# EAGLE design Papa_Soundie (EAGLE 8.7.0)

## Sheet 1 of 2
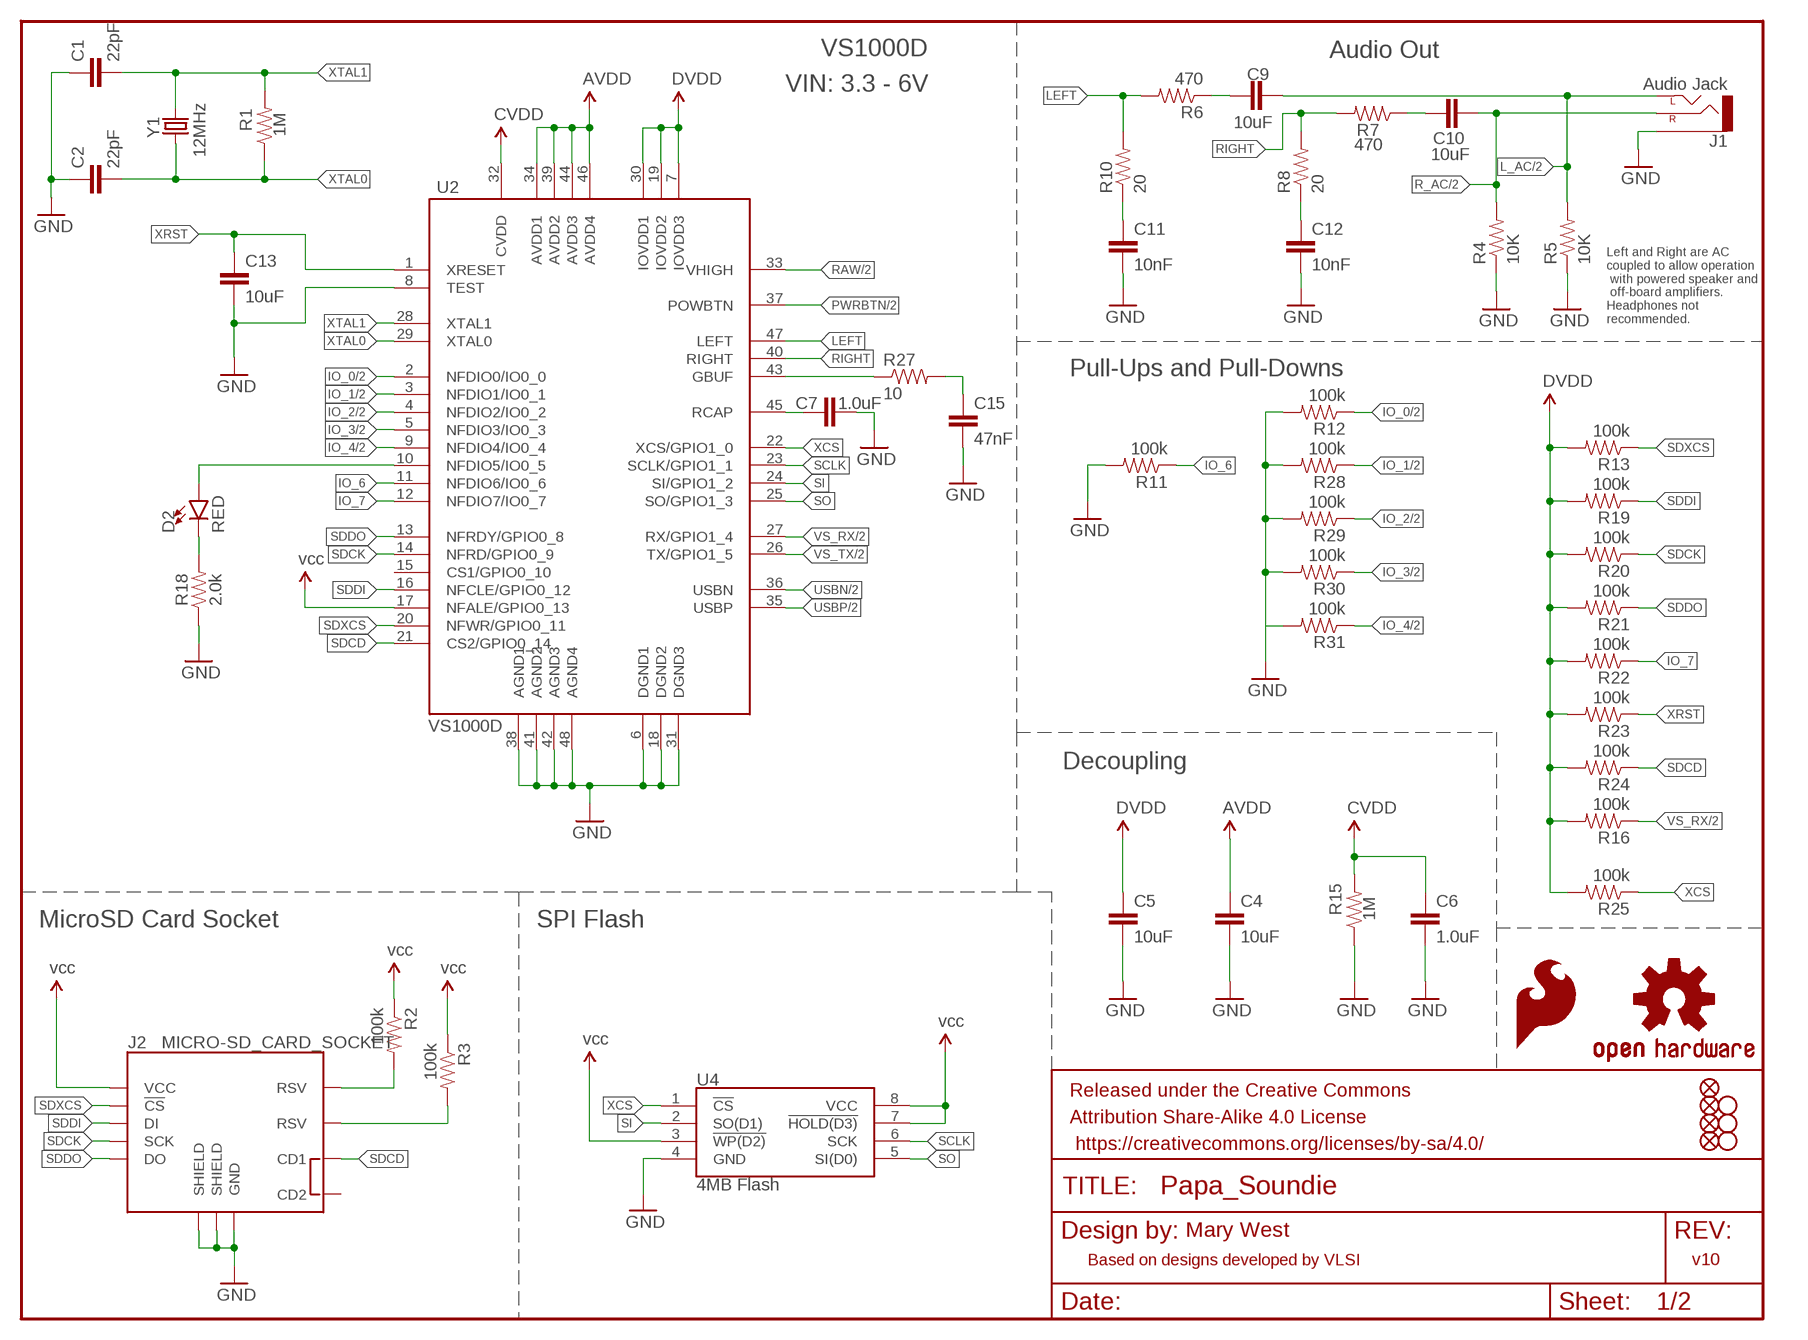
[diagram p0: schematic, sheet 1]

### Parts
C1  22pF  22PF-50V-5%(0603)  [0603-CAP]
C2  22pF  22PF-50V-5%(0603)  [0603-CAP]
C4  10uF  10UF-0603-6.3V-20%  [0603]
C5  10uF  10UF-0603-6.3V-20%  [0603]
C6  1.0uF  1.0UF-16V-10%(0603)  [0603-CAP]
C7  1.0uF  1.0UF-16V-10%(0603)  [0603-CAP]
C9  10uF  10UF-6.3V-20%(0603)  [0603-CAP]
C10  10uF  10UF-6.3V-20%(0603)  [0603-CAP]
C11  10nF  10NF/10000PF-50V-10%(0603)  [0603-CAP]
C12  10nF  10NF/10000PF-50V-10%(0603)  [0603-CAP]
C13  10uF  10UF-6.3V-20%(0603)  [0603-CAP]
C15  47nF  47NF(0.047UF/47000PF)-25V-5%(0603)SMD  [0603-CAP]
D2  RED  LED-RED0603  [LED-0603]
FD1  FIDUCIALUFIDUCIAL  [FIDUCIAL-MICRO]
FD2  FIDUCIALUFIDUCIAL  [FIDUCIAL-MICRO]
FD3  FIDUCIALUFIDUCIAL  [FIDUCIAL-MICRO]
FD4  FIDUCIALUFIDUCIAL  [FIDUCIAL-MICRO]
FRAME1  FRAME-LETTER  [CREATIVE_COMMONS]
H1  STAND-OFFTIGHT  [STAND-OFF-TIGHT]
H2  STAND-OFFTIGHT  [STAND-OFF-TIGHT]
H3  STAND-OFFTIGHT  [STAND-OFF-TIGHT]
J1  Audio Jack  AUDIO-JACKSMD2  [AUDIO-JACK-3.5MM-SMD]
J2  MICRO-SD_CARD_SOCKET  [MICRO-SD-SOCKET]
LOGO1  OSHW-LOGOL  [OSHW-LOGO-L]
LOGO2  SFE_LOGO_FLAME.2_INCH  [SFE_LOGO_FLAME_.2]
R1  1M  1MOHM-1/10W-1%(0603)  [0603-RES]
R2  100k  100KOHM-1/10W-1%(0603)  [0603-RES]
R3  100k  100KOHM-1/10W-1%(0603)  [0603-RES]
R4  10K  10KOHM-1/10W-1%(0603)0603  [0603-RES]
R5  10K  10KOHM-1/10W-1%(0603)0603  [0603-RES]
R6  470  470OHM1/10W1%(0603)  [0603-RES]
R7  470  470OHM1/10W1%(0603)  [0603-RES]
R8  20  20OHM1/10W1%(0603)SMD  [0603-RES]
R10  20  20OHM1/10W1%(0603)SMD  [0603-RES]
R11  100k  100KOHM-1/10W-1%(0603)  [0603-RES]
R12  100k  100KOHM-1/10W-1%(0603)  [0603-RES]
R13  100k  100KOHM-1/10W-1%(0603)  [0603-RES]
R15  1M  1MOHM-1/10W-1%(0603)  [0603-RES]
R16  100k  100KOHM-1/10W-1%(0603)  [0603-RES]
R18  2.0k  2.0KOHM-0603-1/10W-5%  [0603]
R19  100k  100KOHM-1/10W-1%(0603)  [0603-RES]
R20  100k  100KOHM-1/10W-1%(0603)  [0603-RES]
R21  100k  100KOHM-1/10W-1%(0603)  [0603-RES]
R22  100k  100KOHM-1/10W-1%(0603)  [0603-RES]
R23  100k  100KOHM-1/10W-1%(0603)  [0603-RES]
R24  100k  100KOHM-1/10W-1%(0603)  [0603-RES]
R25  100k  100KOHM-1/10W-1%(0603)  [0603-RES]
R27  10  10OHM-1/10W-5%0603SMD  [0603-RES]
R28  100k  100KOHM-1/10W-1%(0603)  [0603-RES]
R29  100k  100KOHM-1/10W-1%(0603)  [0603-RES]
R30  100k  100KOHM-1/10W-1%(0603)  [0603-RES]
R31  100k  100KOHM-1/10W-1%(0603)  [0603-RES]
U2  VS1000D  VS1000  [LQFP-48]
U4  4MB Flash  AT25SF041  [SO08]
Y1  12MHz  CRYSTALCRYSTAL-SMD-5X3-12MHZ  [CRYSTAL-SMD-5X3]

### Nets
AVDD: C4.1 U2.34(AVDD1) U2.39(AVDD2) U2.44(AVDD3) U2.46(AVDD4)
CVDD: C6.1 R15.2 U2.32(CVDD)
DVDD: C5.1 R13.2 R16.2 R19.2 R20.2 R21.2 R22.2 R23.2 R24.2 R25.2 U2.7(IOVDD3) U2.19(IOVDD2) U2.30(IOVDD1)
GBUF: R27.1 U2.43(GBUF)
GND: C1.1 C2.1 C4.2 C5.2 C6.2 C7.2 C11.2 C12.2 C13.2 C15.2 J1.SLEEVE J2.GND J2.GND1(SHIELD) J2.GND3(SHIELD) R4.1 R5.1 R11.2 R12.2 R15.1 R18.1 R28.2 R29.2 R30.2 R31.2 U2.6(DGND1) U2.8(TEST) U2.18(DGND2) U2.31(DGND3) U2.38(AGND1) U2.41(AGND2) U2.42(AGND3) U2.48(AGND4) U4.4(GND) ; also sheet 2
IO_0: R12.1 U2.2(NFDIO0/IO0_0) ; also sheet 2
IO_1: R28.1 U2.3(NFDIO1/IO0_1) ; also sheet 2
IO_2: R29.1 U2.4(NFDIO2/IO0_2) ; also sheet 2
IO_3: R30.1 U2.5(NFDIO3/IO0_3) ; also sheet 2
IO_4: R31.1 U2.9(NFDIO4/IO0_4) ; also sheet 2
IO_6: R11.1 U2.11(NFDIO6/IO0_6)
IO_7: R22.1 U2.12(NFDIO7/IO0_7)
L_AC: C9.2 J1.TIP(LEFT) R5.2 ; also sheet 2
LEFT: R6.2 R10.2 U2.47(LEFT)
N$2: C15.1 R27.2
N$3: C9.1 R6.1
N$6: C11.1 R10.1
N$7: C7.1 U2.45(RCAP)
N$15: J2.RSV1(RSV) R2.2
N$17: C10.1 R7.1
N$19: J2.RSV2(RSV) R3.2
N$20: C12.1 R8.1
N$34: D2.C R18.2
N$35: D2.A U2.10(NFDIO5/IO0_5)
PWRBTN: U2.37(POWBTN) ; also sheet 2
R_AC: C10.2 J1.RING(RIGHT) R4.2 ; also sheet 2
RAW: U2.33(VHIGH) ; also sheet 2
RIGHT: R7.2 R8.2 U2.40(RIGHT)
SCLK: U2.23(SCLK/GPIO1_1) U4.6(SCK)
SDCD: J2.CD1 R24.1 U2.21(CS2/GPIO0_14)
SDCK: J2.SCLK(SCK) R20.1 U2.14(NFRD/GPIO0_9)
SDDI: J2.DI R19.1 U2.16(NFCLE/GPIO0_12)
SDDO: J2.DO R21.1 U2.13(NFRDY/GPIO0_8)
SDXCS: J2.CS(!CS) R13.1 U2.20(NFWR/GPIO0_11)
SI: U2.24(SI/GPIO1_2) U4.2(SO(D1))
SO: U2.25(SO/GPIO1_3) U4.5(SI(D0))
USBN: U2.36(USBN) ; also sheet 2
USBP: U2.35(USBP) ; also sheet 2
VCC: J2.VCC R2.1 R3.1 U2.17(NFALE/GPIO0_13) U4.3(!WP(D2)) U4.7(!HOLD(D3)) U4.8(VCC) ; supply symbol labelled vcc ; also sheet 2
VS_RX: R16.1 U2.27(RX/GPIO1_4) ; also sheet 2
VS_TX: U2.26(TX/GPIO1_5) ; also sheet 2
XCS: R25.1 U2.22(XCS/GPIO1_0) U4.1(!CS)
XRST: C13.1 R23.1 U2.1(XRESET)
XTAL0: C2.2 R1.1 U2.29(XTAL0) Y1.1
XTAL1: C1.2 R1.2 U2.28(XTAL1) Y1.3
Unconnected: J2.CD2 U2.15(CS1/GPIO0_10)

### Notes on the sheet
- VS1000D | Audio Out
- VIN: 3.3 - 6V
- Left and Right are AC
  coupled to allow operation
   with powered speaker and
   off-board amplifiers.
  Headphones not 
  recommended.
- Pull-Ups and Pull-Downs
- Decoupling
- MicroSD Card Socket | SPI Flash
- Mary West
- Based on designs developed by VLSI | v10

## Sheet 2 of 2
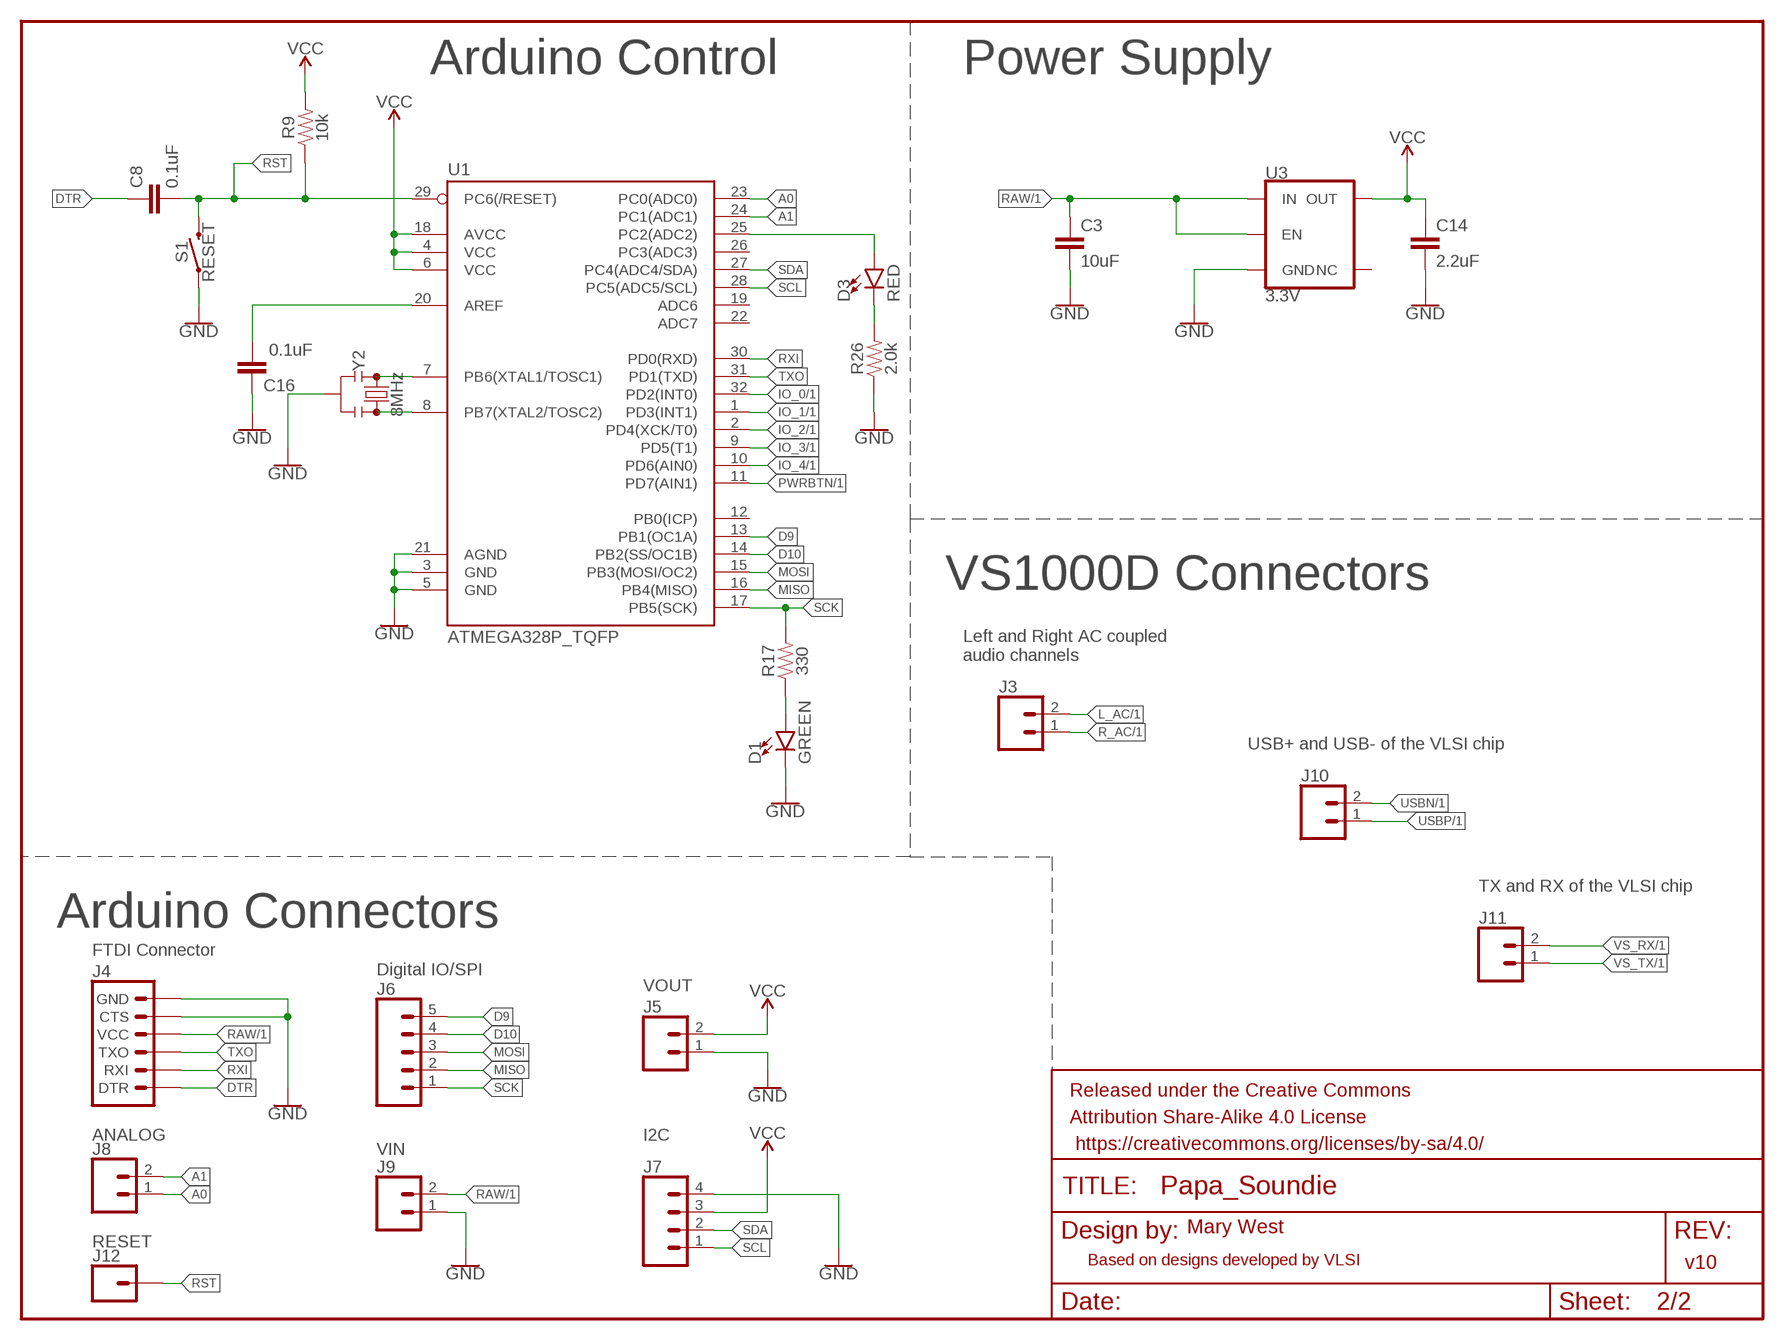
[diagram p1: schematic, sheet 2]

### Parts
C3  10uF  10UF-0603-6.3V-20%  [0603]
C8  0.1uF  0.1UF-0603-25V-(+80/-20%)  [0603]
C14  2.2uF  2.2UF-0603-10V-20%  [0603]
C16  0.1uF  0.1UF-0603-25V-(+80/-20%)  [0603]
D1  GREEN  LED-GREEN0603  [LED-0603]
D3  RED  LED-RED0603  [LED-0603]
FRAME2  FRAME-LETTER  [CREATIVE_COMMONS]
J3  CONN_02  [1X02]
J4  6_PIN_SERIAL_TARGETSILK  [6_PIN_SERIAL_TARGET_SIDE_W_SILK]
J5  CONN_02  [1X02]
J6  CONN_05  [1X05]
J7  CONN_04  [1X04]
J8  CONN_02  [1X02]
J9  CONN_02  [1X02]
J10  CONN_02  [1X02]
J11  CONN_02  [1X02]
J12  CONN_01  [1X01]
R9  10k  10KOHM-0603-1/10W-1%  [0603]
R17  330  330OHM-0603-1/10W-1%  [0603]
R26  2.0k  2.0KOHM-0603-1/10W-5%  [0603]
S1  RESET  MOMENTARY-SWITCH-SPST-SMD-5.2MM  [TACTILE_SWITCH_SMD_5.2MM]
U1  ATMEGA328P_TQFP  [TQFP32-08]
U3  3.3V  V_REG_AP2112K-3.3V  [SOT23-5]
Y2  8MHz  RESONATOR-8MHZSMD_3.2X1.3  [RESONATOR-SMD-3.2X1.3]

### Nets
A0: J8.1 U1.23(PC0(ADC0))
A1: J8.2 U1.24(PC1(ADC1))
D9: J6.5 U1.13(PB1(OC1A))
D10: J6.4 U1.14(PB2(SS/OC1B))
DTR: C8.1 J4.P$1(DTR)
GND: C3.2 C14.2 C16.1 D1.C J4.P$5(CTS) J4.P$6(GND) J5.1 J7.4 J9.1 R26.1 S1.1 U1.3(GND) U1.5(GND) U1.21(AGND) U3.2(GND) Y2.2 ; also sheet 1
IO_0: U1.32(PD2(INT0)) ; also sheet 1
IO_1: U1.1(PD3(INT1)) ; also sheet 1
IO_2: U1.2(PD4(XCK/T0)) ; also sheet 1
IO_3: U1.9(PD5(T1)) ; also sheet 1
IO_4: U1.10(PD6(AIN0)) ; also sheet 1
L_AC: J3.2 ; also sheet 1
MISO: J6.2 U1.16(PB4(MISO))
MOSI: J6.3 U1.15(PB3(MOSI/OC2))
N$8: U1.7(PB6(XTAL1/TOSC1)) Y2.1
N$16: U1.8(PB7(XTAL2/TOSC2)) Y2.3
N$31: D3.A U1.25(PC2(ADC2))
N$36: D3.C R26.2
N$39: C16.2 U1.20(AREF)
N$42: D1.A R17.1
PWRBTN: U1.11(PD7(AIN1)) ; also sheet 1
R_AC: J3.1 ; also sheet 1
RAW: C3.1 J4.P$4(VCC) J9.2 U3.1(IN) U3.3(EN) ; also sheet 1
RST: C8.2 J12.1 R9.1 S1.3 U1.29(PC6(/RESET))
RXI: J4.P$3(RXI) U1.30(PD0(RXD))
SCK: J6.1 R17.2 U1.17(PB5(SCK))
SCL: J7.1 U1.28(PC5(ADC5/SCL))
SDA: J7.2 U1.27(PC4(ADC4/SDA))
TXO: J4.P$2(TXO) U1.31(PD1(TXD))
USBN: J10.2 ; also sheet 1
USBP: J10.1 ; also sheet 1
VCC: C14.1 J5.2 J7.3 R9.2 U1.4(VCC) U1.6(VCC) U1.18(AVCC) U3.5(OUT) ; also sheet 1
VS_RX: J11.2 ; also sheet 1
VS_TX: J11.1 ; also sheet 1
Unconnected: U1.12(PB0(ICP)) U1.19(ADC6) U1.22(ADC7) U1.26(PC3(ADC3)) U3.4(NC)

### Notes on the sheet
- Arduino Control | Power Supply
- VS1000D Connectors
- Left and Right AC coupled 
  audio channels
- USB+ and USB- of the VLSI chip
- TX and RX of the VLSI chip
- Arduino Connectors
- FTDI Connector
- Digital IO/SPI
- VOUT
- ANALOG | I2C
- VIN
- Mary West
- RESET
- Based on designs developed by VLSI | v10

## Library data of the parts
C1 C2 = SparkFun-Capacitors:22PF-50V-5%(0603): CAP-07876; PROD_ID: CAP-07876
C3-C5 = SparkFun-Capacitors:10UF: 10.0µF ceramic capacitors A capacitor is a passive two-terminal electrical component used to store electrical energy temporarily in an electric field.; PROD_ID: CAP-11015
C6 C7 = SparkFun-Capacitors:1.0UF-16V-10%(0603): CAP-00868; PROD_ID: CAP-00868
C8 C16 = SparkFun-Capacitors:0.1UF: 0.1µF ceramic capacitors A capacitor is a passive two-terminal electrical component used to store electrical energy temporarily in an electric field.; PROD_ID: CAP-00810
C9 C10 C13 = SparkFun-Capacitors:10UF-6.3V-20%(0603): CAP-11015; PROD_ID: CAP-11015
C11 C12 = SparkFun-Capacitors:10NF/10000PF-50V-10%(0603): CAP-00867; PROD_ID: CAP-00867
C14 = SparkFun-Capacitors:2.2UF: 2.2µF ceramic capacitors A capacitor is a passive two-terminal electrical component used to store electrical energy temporarily in an electric field.; PROD_ID: CAP-07888
C15 = SparkFun-Capacitors:47NF(0.047UF/47000PF)-25V-5%(0603): CAP-08605; PROD_ID: CAP-08605
D1 = SparkFun-LED:LED-GREEN: Green SMD LED Used in manufacturing of various products at SparkFun Packages: 0603 - SMD 0603 package [Product Link] <http://www.futureelectronics.com/en/technologies/semiconductors/optoelectronics/leds/Pages/9894312-LTST-C190GKT.aspx?CrossPart=HSMG-C190&IM=0> LilyPad 1206 - SMD1206 LilyPad package [Product Link] <http://www.futureelectronics.com/en/Technologies/Product.aspx?ProductID=IN150NGHARVATEKCORPORATION2049943&IM=0> 1206 - SMD1206 package [Product Link] <http://www.futureelectronics.com/en/technologies/semiconductors/optoelectronics/leds/Pages/8315665-LTST-C150KGKT.aspx?IM=0> 1206 Bottom Mount -SMD 1206 Bottom Mount [Product Link] <http://www.digikey.com/product-detail/en/lite-on-inc/LTST-C230KGKT/160-1456-1-ND/386854> SparkFun Products: Pro Mini 328 -5V <https://www.sparkfun.com/products/821> RedBoard <https://www.sparkfun.com/products/12757> MP3 Trigger <https://www.sparkfun.com/products/13720> Makey Makey <https://www.sparkfun.com/products/11076>; PROD_ID: DIO-00821
D2 D3 = SparkFun-LED:LED-RED: Red SMD LED Used in manufacturing of most products at SparkFun Packages: 0603 - SMD 0603 package [Product Link] <http://docs.avagotech.com/docs/AV02-0551EN> 0603 SMART - SMD 0603 SMART package ( more efficient and expensive)[Product Link] <http://www.osram-os.com/Graphics/XPic2/00077099_0.pdf> 1206 - SMD1206 package [Product Link] <https://www.sparkfun.com/datasheets/DevTools/LilyPad/Q150OVS4.pdff> SparkFun Products: Pro Mini 328 -5V <https://www.sparkfun.com/products/821> RedBoard <https://www.sparkfun.com/products/12757> IOIO-OTG <https://www.sparkfun.com/products/13613>; PROD_ID: DIO-00819
FD1-FD4 = SparkFun-Aesthetics:FIDUCIAL: Fiducial Alignment Points Point-of-reference for pick-and-place machines and other optical instruments.
FRAME1 FRAME2 = SparkFun-Aesthetics:FRAME-LETTER: Schematic Frame - Letter Standard 8.5x11 US Letter frame
H1-H3 = SparkFun-Electromechanical:STAND-OFF: #4 Stand Off This is the mechanical footprint for a #4 phillips button head screw. Use the keepout ring to avoid running the screw head into surrounding components. SKU : PRT-00447
J1 = SparkFun-Connectors:AUDIO-JACK: 3.5mm Audio Jack Simple 3.5mm common PCB mount audio jack. Variant PTH is our storefront SKU PRT-08032; PROD_ID: CONN-10353
J2 = SparkFun-Connectors:MICRO-SD_CARD_SOCKET: microSD Socket for Transflash Push-push type µSD socket. tDoc lines correctly indicate media card edge positions when inserting (unlocked, locked, depressed). NOTE: CD1 and CD2 are connected internally, and the default detect state of the socket is detect pin to ground. SparkFun Products: WAV Trigger <https://www.sparkfun.com/products/13660> CAN-Bus Shield <https://www.sparkfun.com/products/13262> SparkFun Level Shifing microSD Breakout <https://www.sparkfun.com/products/13743>; PROD_ID: CONN-07820; SF_ID: PRT-00127
J3 J5 J8-J11 = SparkFun-Connectors:CONN_02: Multi connection point. Often used as Generic Header-pin footprint for 0.1 inch spaced/style header connections On any of the 0.1 inch spaced packages, you can populate with these: Break Away Headers - Straight <https://www.sparkfun.com/products/116> (PRT-00116) Break Away Male Headers - Right Angle <https://www.sparkfun.com/products/553> (PRT-00553) Female Headers <https://www.sparkfun.com/products/115> (PRT-00115) Break Away Headers - Machine Pin <https://www.sparkfun.com/products/117> (PRT-00117) Break Away Female Headers - Swiss Machine Pin <https://www.sparkfun.com/products/743> (PRT-00743) For SCREWTERMINALS and SPRING TERMINALS visit here: Screw Terimnals on SparkFun.com <https://www.sparkfun.com/search/results?term=Screw+Terminals> (5mm/3.5mm/2.54mm spacing) This device is also useful as a general connection point to wire up your design to another part of your project. Our various solder wires solder well into these plated through hole pads. Hook-Up Wire - Assortment (Stranded, 22 AWG) <https://www.sparkfun.com/products/11375> (PRT-11375) Hook-Up Wire - Assortment (Solid Core, 22 AWG) <https://www.sparkfun.com/products/11367> (PRT-11367) View the entire wire category on our website here <https://www.sparkfun.com/categories/141> Special notes: Molex polarized connector foot print use with: PRT-08233 with associated crimp pins and housings. 2.54_SCREWTERM for use with PRT-10571. 3.5mm Screw Terminal footprints for PRT-08084 5mm Screw Terminal footprints for use with PRT-08432
J4 = SparkFun-Connectors:6_PIN_SERIAL_TARGET: 6-pin header connection for use with the "FTDI BASIC" pinout - TARGET SIDE. Also known as "Arduino Serial Program Header". It is used to mate with our FTDI Basic serial programmers using the Arduino IDE. Note, this device has "TARGET" in the name. It is intended to be used on a design that contains a target micro-controller that you wish to program. The "sister" device, named "CABLE" is inteneded to be used on a design that usually lives on the end of your USB cable and prvides the converter chip (FTDI232 or FTDI231x) to commnicate serial RX/TX. You can populate with some of these: Break Away Headers - Straight <https://www.sparkfun.com/products/116> (PRT-00116) For reference (or to suit your programming needs) check out these designs: SparkFun FTDI Basic Breakout - 5V <https://www.sparkfun.com/products/9716> (DEV-09716) SparkFun FTDI Basic Breakout - 3.3V <https://www.sparkfun.com/products/9873> (DEV-09873) SparkFun FTDI SmartBasic <https://www.sparkfun.com/products/12935> (DEV-12935) SparkFun Beefy 3 - FTDI Basic Breakout <https://www.sparkfun.com/products/13746> (DEV-13746)
J6 = SparkFun-Connectors:CONN_05: Multi connection point. Often used as Generic Header-pin footprint for 0.1 inch spaced/style header connections On any of the 0.1 inch spaced packages, you can populate with these: Break Away Headers - Straight <https://www.sparkfun.com/products/116> (PRT-00116) Break Away Male Headers - Right Angle <https://www.sparkfun.com/products/553> (PRT-00553) Female Headers <https://www.sparkfun.com/products/115> (PRT-00115) Break Away Headers - Machine Pin <https://www.sparkfun.com/products/117> (PRT-00117) Break Away Female Headers - Swiss Machine Pin <https://www.sparkfun.com/products/743> (PRT-00743) For SCREWTERMINALS and SPRING TERMINALS visit here: Screw Terimnals on SparkFun.com <https://www.sparkfun.com/search/results?term=Screw+Terminals> (5mm/3.5mm/2.54mm spacing) This device is also useful as a general connection point to wire up your design to another part of your project. Our various solder wires solder well into these plated through hole pads. Hook-Up Wire - Assortment (Stranded, 22 AWG) <https://www.sparkfun.com/products/11375> (PRT-11375) Hook-Up Wire - Assortment (Solid Core, 22 AWG) <https://www.sparkfun.com/products/11367> (PRT-11367) View the entire wire category on our website here <https://www.sparkfun.com/categories/141> Special notes: Molex polarized connector foot print use with SKU : PRT-08231 with associated crimp pins and housings. 1MM SMD Version SKU: PRT-10208
J7 = SparkFun-Connectors:CONN_04: Multi connection point. Often used as Generic Header-pin footprint for 0.1 inch spaced/style header connections On any of the 0.1 inch spaced packages, you can populate with these: Break Away Headers - Straight <https://www.sparkfun.com/products/116> (PRT-00116) Break Away Male Headers - Right Angle <https://www.sparkfun.com/products/553> (PRT-00553) Female Headers <https://www.sparkfun.com/products/115> (PRT-00115) Break Away Headers - Machine Pin <https://www.sparkfun.com/products/117> (PRT-00117) Break Away Female Headers - Swiss Machine Pin <https://www.sparkfun.com/products/743> (PRT-00743) For SCREWTERMINALS and SPRING TERMINALS visit here: Screw Terimnals on SparkFun.com <https://www.sparkfun.com/search/results?term=Screw+Terminals> (5mm/3.5mm/2.54mm spacing) This device is also useful as a general connection point to wire up your design to another part of your project. Our various solder wires solder well into these plated through hole pads. Hook-Up Wire - Assortment (Stranded, 22 AWG) <https://www.sparkfun.com/products/11375> (PRT-11375) Hook-Up Wire - Assortment (Solid Core, 22 AWG) <https://www.sparkfun.com/products/11367> (PRT-11367) View the entire wire category on our website here <https://www.sparkfun.com/categories/141> Special notes: Molex polarized connector foot print use with SKU : PRT-08231 with associated crimp pins and housings. 1MM SMD Version SKU: PRT-10208; PROD_ID: CONN-09696
J12 = SparkFun-Connectors:CONN_01: Single connection point. Often used as Generic Header-pin footprint for 0.1 inch spaced/style header connections On any of the 0.1 inch spaced packages, you can populate with these: Break Away Headers - Straight <https://www.sparkfun.com/products/116> (PRT-00116) Break Away Male Headers - Right Angle <https://www.sparkfun.com/products/553> (PRT-00553) Female Headers <https://www.sparkfun.com/products/115> (PRT-00115) Break Away Headers - Machine Pin <https://www.sparkfun.com/products/117> (PRT-00117) Break Away Female Headers - Swiss Machine Pin <https://www.sparkfun.com/products/743> (PRT-00743) This device is also useful as a general connection point to wire up your design to another part of your project. Our various solder wires solder well into these plated through hole pads. Hook-Up Wire - Assortment (Stranded, 22 AWG) <https://www.sparkfun.com/products/11375> (PRT-11375) Hook-Up Wire - Assortment (Solid Core, 22 AWG) <https://www.sparkfun.com/products/11367> (PRT-11367) View the entire wire category on our website here <https://www.sparkfun.com/categories/141> Special notes: SMTSO-256-ET is a "flush mount" nut for a 4-40 screw. We mostly use this on specialty testbeds; it is a nice way to connect hardware to your PCB at an adjustable hieght. Also note, the SNAP packages are for using a snappable style connector. We sell a baggie of snaps and they are also used on two LilyPad designs: Snap Assortment - 30 pack (male and female) <https://www.sparkfun.com/products/11347> (DEV-11347) LilyPad Arduino SimpleSnap <https://www.sparkfun.com/products/10941> (DEV-10941) LilyPad SimpleSnap Protoboard <https://www.sparkfun.com/products/10940> (DEV-10940)
LOGO1 = SparkFun-Aesthetics:OSHW-LOGO: Open-Source Hardware (OSHW) Logo This logo indicates the piece of hardware it is found on incorporates a OSHW license and/or adheres to the definition of open source hardware found here: http://freedomdefined.org/OSHW
LOGO2 = SparkFun-Aesthetics:SFE_LOGO_FLAME: SparkFun Flame Logo This is the SparkFun flame logo. The logo on the schematic will always be the same size; the package variant is the height of the flame. Default layer for the logo on the board is tSilk.
R1 R15 = SparkFun-Resistors:1MOHM-1/10W-1%(0603): RES-07868; PROD_ID: RES-07868
R2 R3 R11-R13 R16 R19-R25 R28-R31 = SparkFun-Resistors:100KOHM-1/10W-1%(0603): RES-07828; PROD_ID: RES-07828
R4 R5 = SparkFun-Resistors:10KOHM-1/10W-1%(0603): RES-00824; PROD_ID: RES-00824
R6 R7 = SparkFun-Resistors:470OHM1/10W1%(0603): RES-07869; PROD_ID: RES-07869
R8 R10 = SparkFun-Resistors:20OHM1/10W1%(0603): RES-07862; PROD_ID: RES-07862
R9 = SparkFun-Resistors:10KOHM: 10kΩ resistor A resistor is a passive two-terminal electrical component that implements electrical resistance as a circuit element. Resistors act to reduce current flow, and, at the same time, act to lower voltage levels within circuits. - Wikipedia; PROD_ID: RES-00824
R17 = SparkFun-Resistors:330OHM: 330Ω resistor A resistor is a passive two-terminal electrical component that implements electrical resistance as a circuit element. Resistors act to reduce current flow, and, at the same time, act to lower voltage levels within circuits. - Wikipedia; PROD_ID: RES-00818
R18 R26 = SparkFun-Resistors:2.0KOHM: 2kΩ resistor A resistor is a passive two-terminal electrical component that implements electrical resistance as a circuit element. Resistors act to reduce current flow, and, at the same time, act to lower voltage levels within circuits. - Wikipedia; PROD_ID: RES-08296
R27 = SparkFun-Resistors:10OHM-1/10W-5%0603: RES-09834; PROD_ID: RES-09834
S1 = SparkFun-Switches:MOMENTARY-SWITCH-SPST: Momentary Switch (Pushbutton) - SPST Normally-open (NO) SPST momentary switches (buttons, pushbuttons). Variants PTH-12MM - 12mm square, through-hole Momentary Pushbutton Switch - 12mm Square <https://www.sparkfun.com/products/9190> (COM-09190) PTH-6.0MM, PTH-6.0MM-KIT - 6.0mm square, through-hole Mini Pushbutton Switch <https://www.sparkfun.com/products/97> (COM-00097) KIT package intended for soldering kit's - only one side of pads' copper is exposed. PTH-RIGHT-ANGLE-KIT - Right-angle, through-hole Right Angle Tactile Button <https://www.sparkfun.com/products/10791> - Used on SparkFun BigTime Watch Kit <https://www.sparkfun.com/products/11734> SMD-12MM - 12mm square, surface-mount Tactile Button - SMD (12mm) <https://www.sparkfun.com/products/12993> (COM-12993) Used on SparkFun PicoBoard <https://www.sparkfun.com/products/11888> SMD-4.5MM - 4.5mm Square Trackball Switch Used on SparkFun Blackberry Trackballer Breakout <https://www.sparkfun.com/products/13169> SMD-4.6MMX2.8MM - 4.60mm x 2.80mm, surface mount Used on SparkFun SAMD21 Mini Breakout <https://www.sparkfun.com/products/13664> SMD-5.2MM, SMD-5.2-REDUNDANT - 5.2mm square, surface-mount Mini Pushbutton Switch - SMD <https://www.sparkfun.com/products/8720> (COM-08720) Used on Arduino Pro Mini <https://www.sparkfun.com/products/11114> REDUNDANT package connects both switch circuits together SMD-6.0X3.5MM - 6.0 x 3.5mm, surface mount Momentary Reset Switch SMD <https://www.sparkfun.com/products/8229> (COM-08229) SMD-6.2MM-TALL - 6.2mm square, surface mount Tactile Button - SMD (6mm) <https://www.sparkfun.com/products/12992> Used on SparkFun Digital Sandbox <https://www.sparkfun.com/products/12651> SMD-RIGHT-ANGLE - Right-angle, surface mount Used on SparkFun Block for Intel® Edison - Arduino <https://www.sparkfun.com/products/13036>; PROD_ID: SWCH-08247; SF_SKU: COM-08720
U1 = SparkFun-IC-Microcontroller:ATMEGA328P_TQFP: Popular 328P in QFP Storefront component: ATmega328 - TQFP <https://www.sparkfun.com/products/13448> (COM-13448) Datasheet <http://www.sparkfun.com/datasheets/Components/SMD/ATMega328.pdf> SparkFun Products SparkFun RedBoard - Programmed with Arduino <https://www.sparkfun.com/products/12757> (DEV-12757) Arduino Pro Mini 328 - 5V/16MHz <https://www.sparkfun.com/products/11113> (DEV-11113) Arduino Pro Mini 328 - 3.3V/8MHz <https://www.sparkfun.com/products/11114> (DEV-11114) SparkFun OpenLog <https://www.sparkfun.com/products/13712> (DEV-13712) SparkFun MicroView - OLED Arduino Module <https://www.sparkfun.com/products/12923> (DEV-12923) SparkFun Digital Sandbox <https://www.sparkfun.com/products/12651> (DEV-12651) SparkFun PicoBoard <https://www.sparkfun.com/products/11888> (WIG-11888) Arduino Fio <https://www.sparkfun.com/products/10116> (DEV-10116) LilyPad Arduino 328 Main Board <https://www.sparkfun.com/products/13342> (DEV-13342) SparkFun RedStick <https://www.sparkfun.com/products/13741> (DEV-13741) LilyPad MP3 <https://www.sparkfun.com/products/11013> (DEV-11013) LilyPad Arduino SimpleSnap <https://www.sparkfun.com/products/10941> (DEV-10941) SparkFun Stepoko <https://www.sparkfun.com/products/13899> (ROB-13899) SparkFun Geiger Counter <https://www.sparkfun.com/products/11345> (SEN-11345) SparkFun EL Sequencer <https://www.sparkfun.com/products/12781> (COM-12781) Arduino Pro 328 - 5V/16MHz <https://www.sparkfun.com/products/10915> (DEV-10915) CryptoCape <https://www.sparkfun.com/products/12773> (DEV-12773) SparkFun IR Thermometer Evaluation Board - MLX90614 <https://www.sparkfun.com/products/10740> (SEN-10740) SparkFun RedBot Mainboard <https://www.sparkfun.com/products/12097> (ROB-12097) Arduino Pro 328 - 3.3V/8MHz <https://www.sparkfun.com/products/10914> (DEV-10914) SparkFun Block for Intel® Edison - Arduino <https://www.sparkfun.com/products/13036> (DEV-13036) SparkFun Simon Says - Surface Mount Soldering Kit <https://www.sparkfun.com/products/10935> (KIT-10935) SparkFun 7-Segment Serial Display - Red <https://www.sparkfun.com/products/11441> (COM-11441) SparkFun 7-Segment Serial Display - White <https://www.sparkfun.com/products/11629> (COM-11629) SparkFun 7-Segment Serial Display - Yellow <https://www.sparkfun.com/products/11443> (COM-11443) SparkFun 7-Segment Serial Display - Kelly Green <https://www.sparkfun.com/products/11440> (COM-11440) SparkFun 7-Segment Serial Display - Blue <https://www.sparkfun.com/products/11442> (COM-11442) SparkFun OpenSegment Serial Display - 20mm (Blue) <https://www.sparkfun.com/products/11647> (COM-11647) SparkFun OpenSegment Serial Display - 20mm (Green) <https://www.sparkfun.com/products/11646> (COM-11646) SparkFun OpenSegment Serial Display - 20mm (White) <https://www.sparkfun.com/products/11648> (COM-11648) SparkFun OpenSegment Serial Display - 20mm (Red) <https://www.sparkfun.com/products/11644> (COM-11644) SparkFun OpenSegment Serial Display - 20mm (Yellow) <https://www.sparkfun.com/products/11645> (COM-11645) SparkFun OpenSegment Shield <https://www.sparkfun.com/products/13190> (DEV-13190); PROD_ID: IC-09069
U2 = SparkFun-IC-Conversion:VS1000: VS1000D Ogg Vorbis Player IC with USB and NAND FLASH Interface 12 MHz LQFP-48 Datasheet SparkFun Products Storefront component: Ogg Vorbis Codec IC - VS1000D <https://www.sparkfun.com/products/8300> (COM-08300); PROD_ID: LPA-12743
U3 = SparkFun-IC-Power:V_REG_AP2112: AP2112 - 600mA CMOS LDO Regulator w/ Enable The AP2112 is CMOS process low dropout linear regulator with enable function, the regulator delivers a guaranteed 600mA (min.) continuous load current. Features Output Voltage Accuracy: ±1.5% Output Current: 600mA (Min.) Foldback Short Current Protection: 50mA Enable Function to Turn ON/OFF VOUT Low Dropout Voltage (3.3V): 250mV (Typ.) @IOUT=600mA Excellent Load Regulation: 0.2%/A (Typ.) Excellent Line Regulation: 0.02%/V (Typ.) Low Quiescent Current: 55μA (Typ.) Low Standby Current: 0.01μA (Typ.) Low Output Noise: 50μVRMS PSRR: 100Hz -65dB, 1kHz -65dB OTSD Protection Stable with 1.0μF Flexible Cap: Ceramic, Tantalum and Aluminum Electrolytic Operation Temperature Range: -40°C to 85°C ESD: MM 400V, HBM 4000V; PROD_ID: VREG-12457
U4 = SparkFun-IC-Memory:AT25SF041: AT25SF041 4Mb Serial Flash Memory 104MHz, SPI, 8-SOIC Datasheet <http://www.adestotech.com/wp-content/uploads/DS-AT25SF041_044.pdf> SparkFun Products: SparkFun ESP8266 Thing <https://www.sparkfun.com/products/13231> SparkFun ESP8266 Thing - Dev Board <https://www.sparkfun.com/products/13711>; PROD_ID: IC-12455
Y1 = SparkFun-FreqCtrl:CRYSTAL: Various standard crystals. Proven footprints.; PROD_ID: XTAL-08297
Y2 = SparkFun-Clocks:RESONATOR-8MHZ: 8MHz Resonator Digikey Example <http://www.digikey.com/product-detail/en/murata-electronics-north-america/CSTCE10M0G55-R0/490-1196-1-ND/584633> Frequency: 8MHz Frequency Stability: ±0.2% Frequency Tolerance: ±0.5% Capacitance: 33pF SparkFun Products Arduino Pro Mini 328- 3.3V/8MHz <https://www.sparkfun.com/products/11114> SparkFun Digital Sandbox <https://www.sparkfun.com/products/12651>; PROD_ID: XTAL-08895

## Board
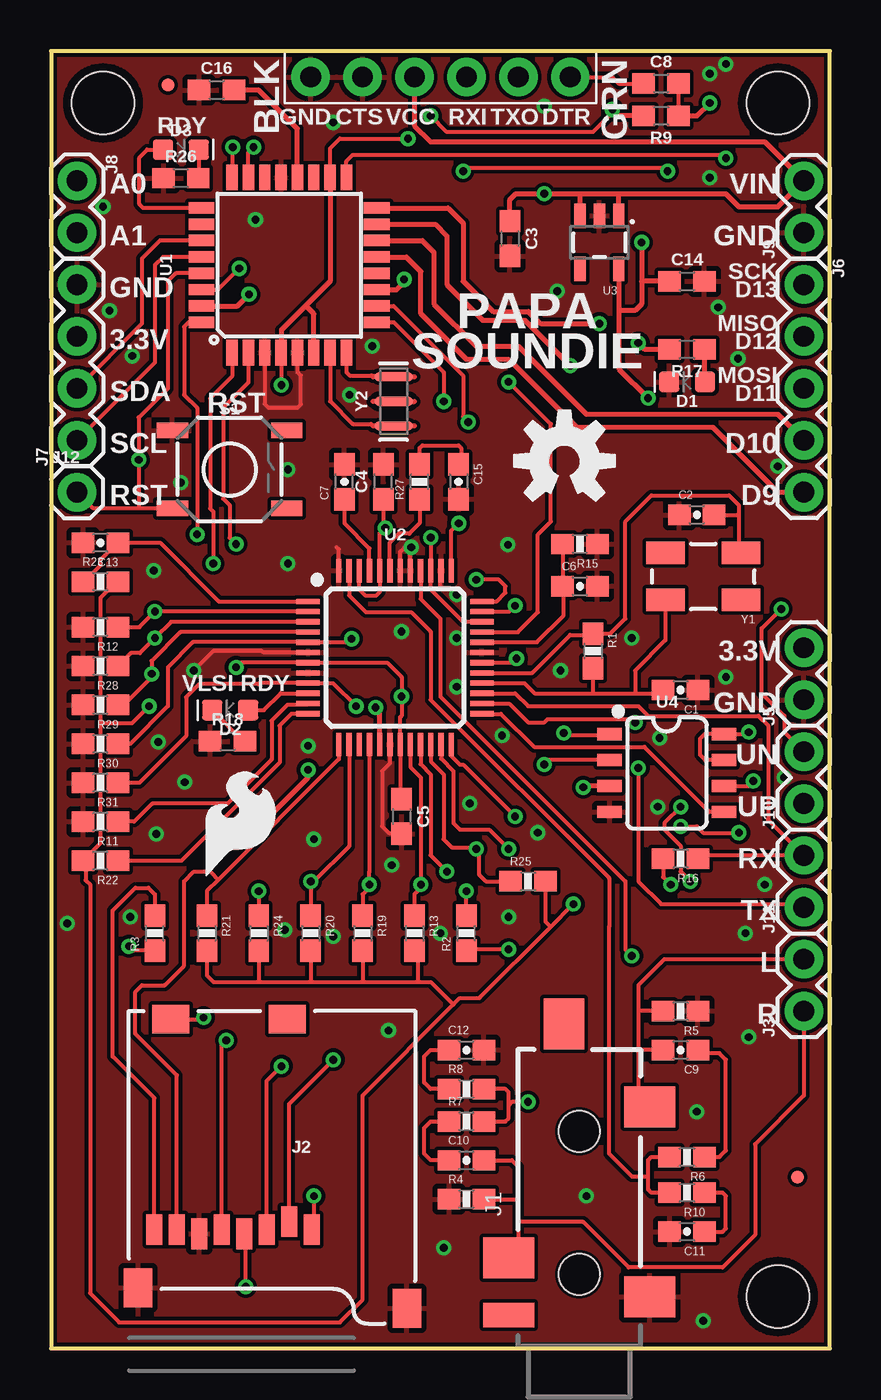
[diagram p2: board, top side]
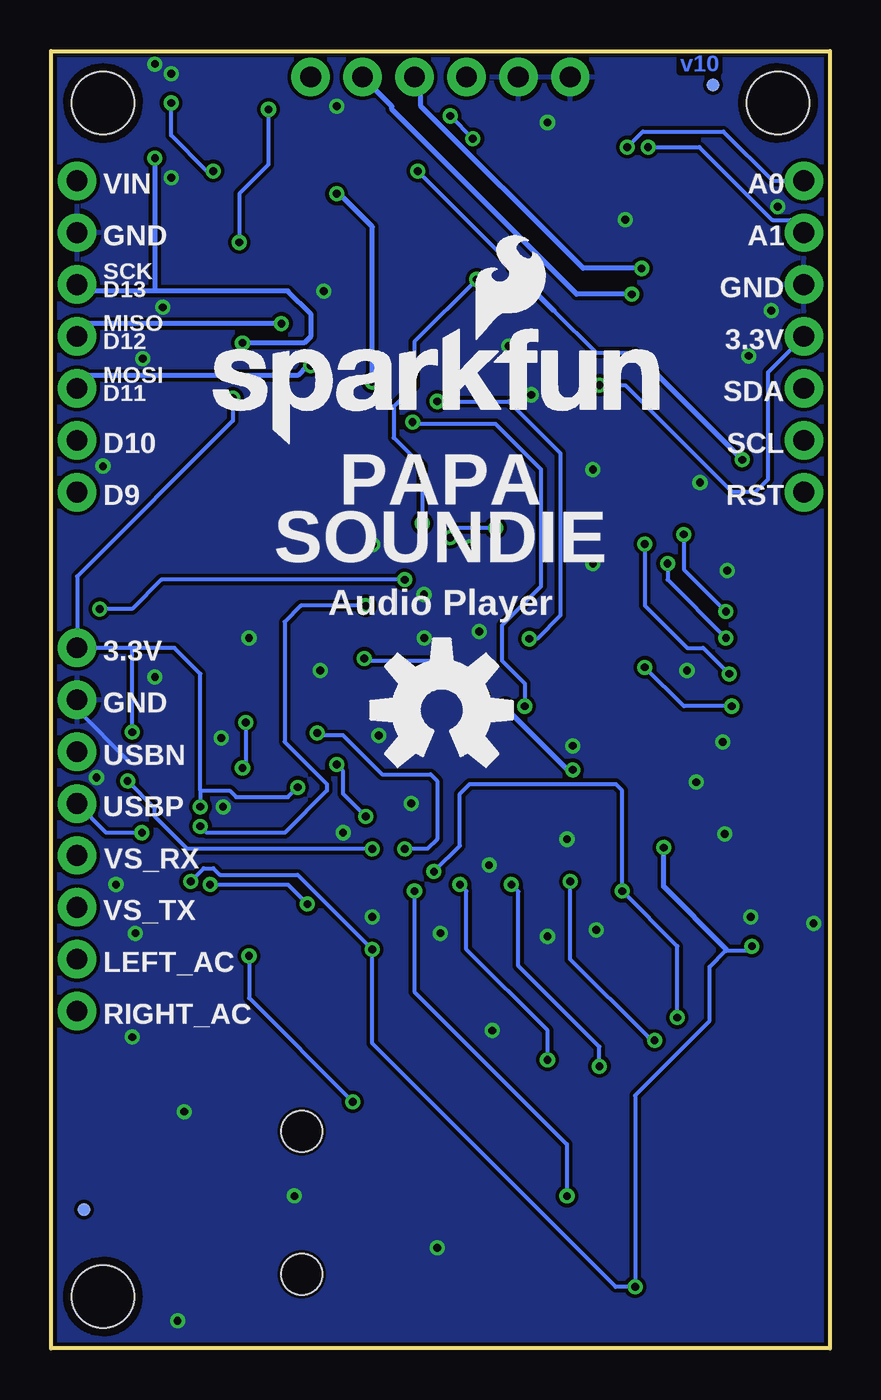
[diagram p3: board, bottom side, seen from below]

Size 38.1 x 63.5 mm. Coordinates in mm from the lower left corner, seen from the top.
Outline: 38.1,63.5 0,63.5 0,0 38.1,0 38.1,63.5
Copper layers (1*16): Top 0.035mm / dielectric 1.5mm / Bottom 0.035mm
Design rules "SparkFun-2-layer-TIGHT": minimum track width 7mil, minimum drill 15mil, track to track 7mil, track to pad 7mil, pad to pad 7mil, via to via 7mil, smd to smd 7mil, copper to edge 7mil, drill to drill 7mil, minimum pad ring 7mil, minimum via ring 7mil, stop-mask expansion 4mil, vias tented up to drill 25mil, thermal gap 10mil

### Footprints (pad centres in the part's own frame; a part is rotated, then mirrored left to right if it is on the bottom)
0603-CAP = smd 1.1 x 1: 1 -0.85,0; 2 0.85,0
0603 = smd 1.1 x 1: 1 -0.85,0; 2 0.85,0
LED-0603 = smd 1 x 1: A -0.877,0; C 0.877,0
FIDUCIAL-MICRO = smd 0.635 x 0.635: 1 0,0
STAND-OFF-TIGHT = hole 3.048: 0,0
AUDIO-JACK-3.5MM-SMD = smd 2 x 2.5: RING 4.3,3.45; SLEEVE 2.4,-3.45; TIP 11.7,-3.45 | smd 1.2 x 2.5: RSH 1.5,3.45 | smd 2.5 x 2: TSH 15.75,0.75 | hole 2: 3.5,0; 10.5,0
MICRO-SD-SOCKET = smd 1.8 x 1.4: CD1 -2.05,0.4; CD2 -7.75,0.4 | smd 0.8 x 1.5: CS -7.84,10.3; DI -6.74,10.7; DO -2.34,10.7; GND -3.44,10.9; RSV1 -8.94,10.7; RSV2 -1.24,10.7; SCLK -4.54,10.7; VCC -5.64,10.9 | smd 1.4 x 1.9: GND1 -13.6,14.55; GND3 -0.45,13.55
1X02 = drill 1.016 pad 1.88: 1 0,0; 2 2.54,0
6_PIN_SERIAL_TARGET_SIDE_W_SILK = drill 1.016 pad 1.88: P$1 -6.35,0; P$2 -3.81,0; P$3 -1.27,0; P$4 1.27,0; P$5 3.81,0; P$6 6.35,0
1X05 = drill 1.016 pad 1.88: 1 0,0; 2 2.54,0; 3 5.08,0; 4 7.62,0; 5 10.16,0
1X04 = drill 1.016 pad 1.88: 1 0,0; 2 2.54,0; 3 5.08,0; 4 7.62,0
1X01 = drill 1.016 pad 1.88: 1 0,0
0603-RES = smd 1.1 x 1: 1 -0.85,0; 2 0.85,0
TACTILE_SWITCH_SMD_5.2MM = smd 1.524 x 0.762: 1 -2.794,1.905; 2 2.794,1.905; 3 -2.794,-1.905; 4 2.794,-1.905
TQFP32-08 = smd 1.27 x 0.559: 1 -4.293,2.8; 2 -4.293,2; 3 -4.293,1.2; 4 -4.293,0.4; 5 -4.293,-0.4; 6 -4.293,-1.2; 7 -4.293,-2; 8 -4.293,-2.8; 17 4.293,-2.8; 18 4.293,-2; 19 4.293,-1.2; 20 4.293,-0.4; 21 4.293,0.4; 22 4.293,1.2; 23 4.293,2; 24 4.293,2.8 | smd 0.559 x 1.27: 9 -2.8,-4.293; 10 -2,-4.293; 11 -1.2,-4.293; 12 -0.4,-4.293; 13 0.4,-4.293; 14 1.2,-4.293; 15 2,-4.293; 16 2.8,-4.293; 25 2.8,4.293; 26 2,4.293; 27 1.2,4.293; 28 0.4,4.293; 29 -0.4,4.293; 30 -1.2,4.293; 31 -2,4.293; 32 -2.8,4.293
LQFP-48 = smd 0.254 x 1.143: 1 -2.75,-4.25; 2 -2.25,-4.25; 3 -1.75,-4.25; 4 -1.25,-4.25; 5 -0.75,-4.25; 6 -0.25,-4.25; 7 0.25,-4.25; 8 0.75,-4.25; 9 1.25,-4.25; 10 1.75,-4.25; 11 2.25,-4.25; 12 2.75,-4.25; 25 2.75,4.25; 26 2.25,4.25; 27 1.75,4.25; 28 1.25,4.25; 29 0.75,4.25; 30 0.25,4.25; 31 -0.25,4.25; 32 -0.75,4.25; 33 -1.25,4.25; 34 -1.75,4.25; 35 -2.25,4.25; 36 -2.75,4.25 | smd 1.143 x 0.254: 13 4.25,-2.75; 14 4.25,-2.25; 15 4.25,-1.75; 16 4.25,-1.25; 17 4.25,-0.75; 18 4.25,-0.25; 19 4.25,0.25; 20 4.25,0.75; 21 4.25,1.25; 22 4.25,1.75; 23 4.25,2.25; 24 4.25,2.75; 37 -4.25,2.75; 38 -4.25,2.25; 39 -4.25,1.75; 40 -4.25,1.25; 41 -4.25,0.75; 42 -4.25,0.25; 43 -4.25,-0.25; 44 -4.25,-0.75; 45 -4.25,-1.25; 46 -4.25,-1.75; 47 -4.25,-2.25; 48 -4.25,-2.75
SOT23-5 = smd 0.55 x 1.2: 1 -0.95,-1.3; 2 0,-1.3; 3 0.95,-1.3; 4 0.95,1.3; 5 -0.95,1.3
SO08 = smd 0.6 x 1.2: 1 -1.905,-2.8; 2 -0.635,-2.8; 3 0.635,-2.8; 4 1.905,-2.8; 5 1.905,2.8; 6 0.635,2.8; 7 -0.635,2.8; 8 -1.905,2.8
CRYSTAL-SMD-5X3 = smd 1.9 x 1.1: 1 -1.85,-1.15; 2 1.85,-1.15; 3 1.85,1.15; 4 -1.85,1.15
RESONATOR-SMD-3.2X1.3 = smd 0.45 x 1.905: 1 -1.2,0; 2 0,0; 3 1.2,0

### Placement (x,y rotation side)
C1  30.8,32.23 180 top
C2  31.59,40.8 0 top
C3  22.45,54.32 270 top
C4  16.26,42.42 90 top
C5  17.14,26.04 270 top
C6  25.88,37.31 0 top
C7  14.35,42.42 90 top
C8  29.84,61.91 0 top
C9  30.8,14.61 180 top
C10  20.32,9.21 0 top
C11  31.11,5.71 180 top
C12  20.32,14.61 0 top
C13  2.41,39.43 180 top
C14  31.11,52.23 0 top
C15  19.94,42.42 270 top
C16  8.1,61.59 0 top
D1  31.11,47.31 180 top
D2  8.76,31.24 180 top
D3  6.35,58.67 0 top
FD1  5.71,61.85 90 top
FD2  36.51,8.38 90 top
FD3  5.71,61.85 180 bottom
FD4  36.48,6.79 180 bottom
FRAME1  -15.08,-23.81 0 top  (outside the outline)
FRAME2  -15.08,-23.81 0 top  (outside the outline)
FRAME3  FRAME-LETTER  [CREATIVE_COMMONS]  -15.08,-23.81 0 top  (outside the outline)
H1  35.56,60.96 90 top
H2  2.54,60.96 180 top
H3  35.56,2.54 0 top
J1  25.84,0.13 90 top
J2  3.81,16.51 180 top
J3  36.83,16.51 90 top
J4  19.05,62.23 180 top
J5  36.83,31.75 90 top
J6  36.83,52.07 270 top
J7  1.27,44.45 90 top
J8  1.27,57.15 270 top
J9  36.83,54.61 90 top
J10  36.83,26.67 90 top
J11  36.83,21.59 90 top
J12  1.27,41.91 0 top
LOGO1  18.99,31.24 0 bottom
LOGO2  7.24,22.86 0 top
LOGO3  OSHW-LOGOL  [OSHW-LOGO-M]  25.11,43.43 0 top
LOGO6  SFE_LOGO_NAME_FLAME.1_INCH  [SFE_LOGO_NAME_FLAME_.2]  30.87,44.2 0 bottom
R1  26.51,34.13 270 top
R2  20.32,20.32 90 top
R3  5.08,20.32 90 top
R4  20.32,7.3 0 top
R5  30.8,16.51 180 top
R6  31.11,9.37 180 top
R7  20.32,11.11 0 top
R8  20.32,12.7 0 top
R9  29.84,60.33 180 top
R10  31.11,7.62 180 top
R11  2.41,25.78 180 top
R12  2.41,35.31 180 top
R13  17.78,20.32 270 top
R15  25.88,39.37 180 top
R16  30.8,23.97 180 top
R17  31.11,48.9 180 top
R18  8.64,29.72 0 top
R19  15.24,20.32 270 top
R20  12.7,20.32 270 top
R21  7.62,20.32 270 top
R22  2.41,23.88 180 top
R23  2.41,37.53 0 top
R24  10.16,20.32 270 top
R25  23.34,22.86 0 top
R26  6.35,57.28 0 top
R27  18.03,42.42 90 top
R28  2.41,33.4 180 top
R29  2.41,31.5 180 top
R30  2.41,29.59 180 top
R31  2.41,27.69 180 top
S1  8.73,43.02 0 top
U1  11.65,53.02 90 top
U2  16.83,33.81 270 top
U3  26.83,54.13 180 top
U4  30.13,28.16 270 top
Y1  31.91,37.78 180 top
Y2  16.76,46.35 90 top

### Tracks (layer width: path | path; a pad name or v marks a point on that pad's centre or on a via)
A0  (via drill 0.38)
  Top 0.203: U1.23 9.65,58.55 v9.91,58.8 10.03,58.93
  Bottom 0.203: v9.91,58.8 9.14,59.56 5.21,59.56 2.79,57.15 J8.1
A1  (via drill 0.38)
  Top 0.203: U1.24 8.89,57.35 v8.89,58.8
  Bottom 0.203: J8.2 1.89,55.23 2.81,55.23 6.38,58.8 v8.89,58.8
AVDD  (via drill 0.38)
  Top 0.203: U2.34 20.16,35.56 18.57,37.15 U2.39 v18.57,39.69 | U2.46 15.08,37.15 15.4,36.83 15.88,36.83 16.08,37.03 U2.44 16.08,39.89 v16.35,40.16 | 16.29,40.23 v16.35,40.16 | C4.1 16.26,40.26 v16.35,40.16
  Bottom 0.203: v16.35,40.16 18.26,40.16 18.57,39.85 v18.57,39.69
CVDD
  Top 0.203: U2.32 23.77,34.56 25.08,35.88 25.08,37.25 C6.1 R15.2
D9
  Top 0.254: U1.13 17.38,53.42 18.1,52.7 18.1,50.64 20.32,48.42 22.38,48.42 25.72,45.09 32.38,45.09 35.56,41.91 J6.5
D10
  Top 0.254: U1.14 18.17,54.22 18.73,53.66 18.73,51.12 20.8,49.05 22.86,49.05 26.19,45.72 35.56,45.72 J6.4
DTR
  Top 0.203: J4.P$1 27.46,62.23 27.78,61.91 C8.1
DVDD  (via drill 0.38)
  Top 0.203: C5.1 17.08,26.95 U2.19 17.08,30.89 17.14,30.96 v17.14,31.91 17.14,32.86 16.44,33.56 U2.7 9.28,33.56 v9.05,33.34 | R21.2 7.62,18.26 7.94,17.94 10.16,17.94 | 10.16,17.94 12.7,17.94 | 12.7,17.94 15.24,17.94 | 15.24,17.94 17.94,17.94 | 17.94,17.94 18.57,17.94 19.68,16.83 | R13.2 17.94,19.31 17.94,17.94 | R19.2 15.24,17.94 | R24.2 10.16,17.94 | R20.2 12.7,17.94 | R23.2 3.21,37.53 2.41,36.73 2.41,30.61 | 2.41,30.61 2.41,24.73 R22.2 1.69,23.75 1.69,22.92 1.91,22.7 1.91,2.7 3.33,1.27 14.13,1.27 15.24,2.38 15.24,12.38 19.68,16.83 | 19.68,16.83 20,17.14 20.95,17.14 24.45,20.64 | 24.45,20.64 v25.56,21.75 | R16.2 29.95,23.07 v30.32,22.7 | U2.30 22.56,33.56 v22.77,33.77 | R25.2 24.19,20.9 24.45,20.64 | 2.41,30.61 3.97,30.61 v4.79,31.43
  Bottom 0.203: v17.14,31.91 18.89,33.66 22.65,33.66 v22.77,33.77 | v30.32,22.7 26.51,22.7 v25.56,21.75 | v4.79,31.43 7.14,31.43 v9.05,33.34
GBUF
  Top 0.203: U2.43 16.58,39.44 17.02,39.88 17.53,39.88 18.03,40.39 R27.1
GND  (via drill 0.38)
  Top 0.203: U2.6 10.39,34.06 10.32,34.13 7.94,34.13 v6.99,33.18 | U2.18 16.58,28.64 16.19,28.26 16.19,25.56 16.51,25.24 17.09,25.24 C5.2 | U1.3 10.45,46.22 10.64,46.04 12.06,46.04 12.22,46.2 12.22,47.62 12.06,47.78 12.06,48.72 U1.5 | U2.48 14.08,39.1 13.97,39.21 | U2.41 17.58,39.1 17.46,39.21 17.3,39.21 17.08,38.98 U2.42 | v19.85,36.9 19.54,37.21 19.05,37.21 19.05,38.04 U2.38
  Bottom 0.203: J5.1 36.83,31.27 34.29,28.73
  other vias: 24.92,33.18 6.35,42.39 11.59,43.02 11.59,38.42 24.13,60.8 32.23,62.39 33.02,62.87 2.54,55.88 3.97,48.58 5.02,38.07 24.77,51.75 32.64,50.96 33.61,48.45 5.24,29.69 12.86,24.92 31.59,11.59 33.97,20.32 29.69,26.51 11.43,20.48 13.81,20.16 17.62,39.21 19.84,34.77 19.84,32.38 17.14,35.08 6.54,27.72 33.02,32.86 29.77,29.89 20.48,26.67 23.81,25.24 22.38,21.11 34.92,22.7 32.23,57.31 16.67,23.65 35.88,27.94 22.07,30 16.51,15.56 19.21,4.92 26.19,7.46 34.13,15.24 31.91,1.36 14.61,46.67 15.72,49.05 10,55.24 13.81,60.01 2.86,50.8 28.42,34.77 22.35,39.34 0.79,20.8 19.05,20.32 35.56,43.18 5.14,25.18 12.57,29.5 3.87,21.11
  pour Bottom: 38.1,0 0,0 0,63.5 38.1,63.5
  pour Top: 38.1,0 0,0 0,63.5 38.1,63.5
IO_0  (via drill 0.38)
  Top 0.203: U2.2 v5.08,36.06 4.32,35.31 R12.1 | U1.32 6.72,50.22 6.51,50.01 6.51,46.67 7.14,46.04 v7.14,39.85
  Bottom 0.203: v7.14,39.85 7.14,38.13 v5.08,36.06
IO_1  (via drill 0.38)
  Top 0.203: U2.3 5.88,35.56 v5.08,34.77 4.35,34.04 3.9,34.04 R28.1 | U1.1 8.85,47.59 7.78,46.51 7.78,41.12 7.94,40.96 v7.94,38.42
  Bottom 0.203: v7.94,38.42 7.94,37.62 v5.08,34.77
IO_2  (via drill 0.38)
  Top 0.203: U2.4 6.33,35.06 4.92,33.66 v4.92,33.02 4.92,32.86 3.56,31.5 R29.1 | U1.2 9.65,47.28 8.41,46.04 8.41,41.59 8.73,41.27 8.73,39.69 v9.05,39.37
  Bottom 0.203: v9.05,39.37 9.05,36.35 6.99,34.29 6.19,34.29 v4.92,33.02
IO_3  (via drill 0.38)
  Top 0.203: U1.9 16.77,50.22 19.21,47.78 v19.21,46.35 | R30.1 3.87,29.59 5.71,31.43 5.71,33.34 6.94,34.56 U2.5 14.53,34.56 v14.7,34.73
  Bottom 0.203: v19.21,46.35 15.72,46.35 13.18,43.81 13.18,35.88 14.32,34.73 v14.7,34.73
IO_4  (via drill 0.38)
  Top 0.203: U1.10 16.76,51.02 20.16,47.62 20.16,45.59 v20.41,45.34 | v14.92,31.43 13.79,32.56 U2.9 10.21,32.56 10.16,32.51 7.24,32.51 6.6,31.88 6.6,29.97 4.32,27.69 R31.1 3.39,27.81
  Bottom 0.203: v14.92,31.43 14.92,32.54 16.03,33.66 16.03,35.4 14.13,37.31 14.13,43.02 16.35,45.24 20.32,45.24 v20.41,45.34
IO_6
  Top 0.203: U2.11 12.51,31.5 11.56,31.5 10.79,30.73 10.79,28.83 8.64,26.67 4.95,26.67 4.06,25.78 R11.1
IO_7
  Top 0.203: U2.12 11.76,31.06 11.18,30.48 11.18,28.67 7.32,24.81 7.27,24.77 6.38,23.88 R22.1
L_AC
  Top 0.203: 28.73,14.61 28.73,12.39 J1.TIP | C9.2 28.73,14.61 | J3.2 30,19.05 28.73,17.78 28.73,16.51 | 28.73,16.51 28.73,14.61 | R5.2 28.73,16.51
LEFT
  Top 0.203: R10.2 29.37,7.62 29.21,7.78 29.21,8.41 | 29.21,8.41 29.21,9.21 29.37,9.37 R6.2 | U2.47 14.58,36.86 15.4,36.04 17.62,36.04 18.57,35.08 18.57,31.75 27.3,23.02 27.3,20.64 27.3,20.16 27.3,9.53 28.42,8.41 29.21,8.41
MISO  (via drill 0.38)
  Top 0.254: U1.16 19.43,55.82 20.16,55.09 20.16,52.23 21.63,50.76 23.36,50.76 23.95,50.16 v26.83,50.16
  Bottom 0.254: v26.83,50.16 36.2,50.16 J6.2
MOSI  (via drill 0.38)
  Top 0.254: U1.15 18.8,55.02 19.37,54.45 19.37,52.07 21.11,50.32 23.18,50.32 v25.4,48.1
  Bottom 0.254: v25.4,48.1 25.56,48.1 26.04,47.62 36.2,47.62 J6.3
N$2
  Top 0.203: R27.2 18.03,44.07 18.16,44.2 19.94,44.2 20.07,44.07 20.07,43.4 C15.1
N$3
  Top 0.203: R6.1 32.7,9.37 33.02,9.68 33.02,14.13 32.7,14.45 31.81,14.45 C9.1
N$6
  Top 0.203: C11.1 32.86,5.71 33.02,5.87 33.02,7.46 32.86,7.62 R10.1
N$7
  Top 0.203: U2.45 15.58,39.16 14.35,40.39 C7.1
N$8
  Top 0.203: U1.7 13.65,46.35 14.76,45.24 15.66,45.24 15.75,45.16
N$15  (via drill 0.38)
  Top 0.203: R2.2 v20.32,22.38 | v12.86,7.46 12.86,5.92 J2.RSV1
  Bottom 0.203: v20.32,22.38 20.32,17.46 12.86,10 v12.86,7.46
N$16
  Top 0.203: U1.8 14.45,47.78 14.61,47.62 15.68,47.62 15.75,47.55
N$17
  Top 0.203: C10.1 18.57,9.21 18.26,9.53 18.26,10.79 18.57,11.11 R7.1
N$19
  Top 0.203: J2.RSV2 5.05,12.25 3.02,14.29 3.02,21.43 4.13,22.54 4.76,22.54 5.08,22.23 R3.2
N$20
  Top 0.203: R8.1 18.57,12.7 18.26,13.02 18.26,14.29 18.57,14.61 C12.1
N$31
  Top 0.203: U1.25 4.5,55.82 4.32,56.01 4.32,58.29 4.7,58.67 D3.A
N$34
  Top 0.203: D2.C 9.41,29.72 R18.2
N$35
  Top 0.203: U2.10 11.24,32.06 10.41,31.24 D2.A
N$36
  Top 0.203: D3.C 7.24,57.28 R26.2
N$39
  Top 0.254: U1.20 12.05,59.7 10.16,61.59 C16.2
N$42
  Top 0.254: R17.1 31.96,47.33 D1.A
PWRBTN  (via drill 0.38)
  Top 0.203: 19.58,38.63 U2.37 19.58,40.02 v19.94,40.39
  Top 0.254: U1.11 16.9,51.82 17.27,52.2 v17.27,52.32
  Bottom 0.203: v17.27,52.32 20.32,49.28 20.32,47.12 21.34,46.1 21.34,44.58 19.94,43.18 v19.94,40.39
R_AC
  Top 0.203: C10.2 22.54,9.21 22.86,8.89 22.86,7.3 | 22.86,7.3 22.86,6.19 | 22.86,6.19 22.86,4.89 J1.RING | R4.2 22.86,7.3 | J3.1 36.83,12.38 34.45,10 34.45,5.56 32.86,3.97 28.26,3.97 26.04,6.19 22.86,6.19
RAW  (via drill 0.38)
  Top 0.203: U2.33 22.84,35.06 23.81,36.04 23.81,39.85 24.45,40.48 24.45,45.24 v22.38,47.31
  Top 0.254: J4.P$4 17.78,59.85 18.57,59.05 34.92,59.05 J9.2 35.56,55.88 33.66,55.88 33.02,56.52 27.81,56.52 | U3.1 27.78,56.48 27.81,56.52 | 25.91,56.52 27.81,56.52 | U3.3 25.88,56.49 25.91,56.52 | C3.1 22.45,56.23 22.73,56.52 v24.13,56.52 25.91,56.52
  Bottom 0.254: v22.38,47.31 22.38,54.9 24,56.52 v24.13,56.52
RIGHT  (via drill 0.38)
  Top 0.203: R7.2 22.23,11.11 22.38,11.27 22.38,11.91 | 22.38,11.91 22.38,12.54 22.23,12.7 R8.2 | U2.40 18.08,36.69 19.05,35.72 19.05,31.91 28.1,22.86 28.1,19.53 v28.42,19.21 | v23.34,12.06 22.54,12.06 22.38,11.91
  Bottom 0.203: v28.42,19.21 28.42,17.14 v23.34,12.06
RST  (via drill 0.38)
  Top 0.203: U1.29 6.11,52.62 5.71,52.23 5.71,46.99 4.29,45.56 v4.29,43.5 4.29,41.15 4.32,41.12 | C8.2 R9.1 | v20.16,57.63 20.32,57.78 30,57.78 v30.16,57.63 | 4.32,41.12 2.06,41.12 J12.1 | S1.3 4.32,41.12
  Top 0.254: R9.1 31.59,60.33 v32.23,60.96
  Bottom 0.203: 15.56,52.86 15.56,53.02 v20.16,57.63 | v30.16,57.63 30.48,57.63 32.23,59.37 v32.23,60.96 | 13.49,50.8 11.43,48.74 9.53,48.74 8.89,48.1
  Bottom 0.254: 15.56,52.86 13.49,50.8 | 8.89,48.1 v4.29,43.5
RXI  (via drill 0.38)
  Top 0.203: U1.30 8.17,51.82 v9.21,52.86
  Bottom 0.254: v9.21,52.86 12.06,52.86 20,60.8 20,61.91 J4.P$3
SCK  (via drill 0.38)
  Top 0.203: U1.17 14.45,58.11 14.76,58.42 32.86,58.42 v33.02,58.26
  Top 0.254: R17.2 29.05,48.9 v28.73,49.21
  Bottom 0.254: 33.02,51.75 26.51,51.75 25.4,50.64 25.4,49.53 25.72,49.21 v28.73,49.21 | 33.02,51.75 36.51,51.75 J6.1 | v33.02,58.26 33.02,51.75
SCL
  Top 0.203: U1.28 5.48,53.42 5.08,53.02 5.08,48.26 J7.1
SCLK  (via drill 0.38)
  Top 0.203: U2.23 19.08,28.86 19.68,28.26 19.68,25.72 20,25.4 21.43,25.4 v22.38,24.45 | U4.6 34.11,27.53 v34.36,27.77
  Bottom 0.203: v22.38,24.45 31.43,24.45 33.02,26.04 33.02,26.43 v34.36,27.77
SDA
  Top 0.203: U1.27 5.33,54.22 4.45,53.34 4.45,50.16 J7.2
SDCD  (via drill 0.38)
  Top 0.203: U2.21 18.08,28.59 18.57,28.1 18.57,24.13 v19.37,23.34 | v10.16,22.38 R24.1 | J2.CD1 7.38,16.11 v7.46,16.19
  Bottom 0.203: v7.46,16.19 7.46,19.68 v10.16,22.38 10.16,27.3 10.48,27.62 17.62,27.62 18.1,27.15 18.1,24.61 v19.37,23.34
SDCK  (via drill 0.38)
  Top 0.203: U2.14 14.58,24.58 12.86,22.86 v12.7,22.86 R20.1 | J2.SCLK 8.35,14.86 v8.57,15.08
  Bottom 0.203: v8.57,15.08 8.57,15.24 8.89,15.24 12.7,19.05 v12.7,22.86
SDDI  (via drill 0.38)
  Top 0.203: U2.16 15.58,23.34 v15.58,22.7 15.58,22.56 15.24,22.23 R19.1 | J2.DI 10.55,13.09 v11.27,13.81
  Bottom 0.203: v11.27,13.81 11.27,14.76 15.24,18.73 15.24,22.36 v15.58,22.7
SDDO
  Top 0.203: U2.13 14.08,28.84 8.18,22.94 | 8.18,22.94 7.62,22.38 R21.1 | J2.DO 6.15,13.38 4.13,15.4 4.13,17.46 4.45,17.78 5.56,17.78 6.51,18.73 6.51,22.86 6.99,23.34 7.78,23.34 8.18,22.94
SDXCS  (via drill 0.38)
  Top 0.203: U2.20 17.58,28.46 18.1,27.94 v18.1,22.7 18.1,22.54 17.78,22.23 R13.1 | J2.CS 11.65,11.97 v13.81,14.13
  Bottom 0.203: v13.81,14.13 13.81,15.56 17.78,19.53 17.78,22.38 v18.1,22.7
SI  (via drill 0.38)
  Top 0.203: U2.24 19.58,29 20,28.57 20.16,28.57 v22.7,26.04 | U4.2 24.35,28.8 v24.13,28.57
  Bottom 0.203: 22.86,26.19 v22.7,26.04 23.81,27.15 23.81,28.26 v24.13,28.57
SO
  Top 0.203: U2.25 22.01,31.06 23.63,29.44 29.03,29.44 32.16,26.31 32.16,26.26 U4.5
TXO  (via drill 0.38)
  Top 0.254: U1.31 9.11,51.02 v9.68,51.59
  Bottom 0.254: v9.68,51.59 12.38,51.59 21.43,60.64 21.43,60.8 J4.P$2
USBN  (via drill 0.38)
  Top 0.203: U2.36 21.8,36.56 22.23,36.99 22.23,37.31 21.91,37.62 v20.8,37.62 | J10.2 35.88,30.16 35.88,30.96 34.77,32.07 34.77,35.24 v35.72,36.2
  Bottom 0.203: v20.8,37.62 32.7,37.62 34.13,36.2 v35.72,36.2
USBP  (via drill 0.38)
  Top 0.203: U2.35 22.41,36.06 v22.7,36.35 | v30.8,25.56 31.59,25.56 31.91,25.24 v33.66,25.24
  Bottom 0.203: v22.7,36.35 25.88,36.35 26.67,35.56 26.67,29.69 24.61,27.62 24.61,27.3 26.67,25.24 30.48,25.24 v30.8,25.56 | v33.66,25.24 35.4,25.24 J10.1
VCC  (via drill 0.38)
  Top 0.203: R3.1 4.03,19.47 v3.81,19.68 | v9.53,3.02 9.53,5.54 J2.VCC | 11.27,49.85 v11.27,47.15 | 29.05,46.67 v29.21,46.51 | v18.57,60.33 19.37,59.53 26.51,59.53 27.46,60.48 v27.46,60.64 | v17.46,59.21 14.13,59.21 13.65,58.74 U1.18 | v22.38,19.53 20.32,19.53 R2.1 | v31.27,22.86 30.8,23.34 30.8,24.61 30,25.4 30,25.72 v30.8,26.51 | 26.1,27.53 v26.04,27.46 | U4.7 32,28.8 31.75,29.05 31.75,29.84 31.97,30.07 U4.8 34.04,30.07 v34.13,30.16
  Top 0.254: U1.18 13.65,52.23 12.46,51.04 | 12.46,51.04 11.27,49.85 11.27,48.75 U1.4 | U1.6 12.85,50.65 12.46,51.04 | R9.2 27.78,60.33 v27.46,60.64 | U3.5 27.78,50.8 | v29.21,46.51 27.78,47.95 27.78,50.8 | v28.89,54.13 28.89,52.23 | C14.1 28.89,52.23 | 28.89,52.23 28.89,51.12 28.57,50.8 27.78,50.8 | 15.88,31.5 v15.88,31.37 16.08,31.17 U2.17 | v12.57,28.32 12.57,27.94 9.14,24.51 v8.13,24.51 | U4.3 26.04,27.53 v26.04,27.46
  Bottom 0.203: v11.27,47.15 10,47.15 4.76,41.91 3.65,41.91 3.02,42.55 3.02,47.78 J7.3 | v29.21,46.51 29.21,45.4 36.83,37.78 J5.2 34.09,34.29 | v27.46,60.64 27.46,57.94 28.89,56.52 v28.89,54.13 | v3.81,19.68 4.03,19.47 R3.1 5.87,18.68 5.87,16.03 9.53,12.38 v9.53,3.02 10.48,3.02 22.38,14.92 v22.38,19.53 26.04,23.18 29.84,23.18 30.16,23.5 30.64,23.5 v31.27,22.86 | 30.8,27.3 v30.8,26.51 | 30.8,27.3 29.37,27.3 29.05,26.99 26.51,26.99 v26.04,27.46 | v18.57,60.33 v17.46,59.21 | 30.8,27.3 30.8,33.02 32.07,34.29 34.09,34.29 | v34.13,30.16 34.13,34.25 34.09,34.29
  Bottom 0.254: v15.88,31.37 12.83,28.32 v12.57,28.32 | v8.13,24.51 8.13,22.61 5.08,19.56 R3.1
VS_RX
  Top 0.203: U2.27 22.7,32.06 23.34,31.43 28.73,31.43 29.21,30.96 34.61,30.96 35.08,30.48 35.08,25.88 J11.2 31.81,24.13 R16.1 31.43,24.19
VS_TX  (via drill 0.38)
  Top 0.203: U2.26 22.41,31.56 23.34,30.64 24.13,30.64 24.29,30.8 28.42,30.8 v28.57,30.64 | v28.73,28.42 28.73,22.86 29.84,21.75 36.67,21.75 J11.1
  Bottom 0.203: v28.57,30.64 28.57,28.57 v28.73,28.42
XCS  (via drill 0.38)
  Top 0.203: U2.22 18.58,28.73 19.21,28.1 19.21,24.92 19.61,24.53 20.72,24.53 v20.8,24.45 20.95,24.29 20.95,23.18 21.27,22.86 R25.1 | U4.1 27.27,30 25.2,30 v25.08,30.12
  Bottom 0.203: v25.08,30.12 24.96,30 23.81,30 21.91,28.1 19.53,28.1 19.21,27.78 19.21,24.92 19.68,24.45 v20.8,24.45
XRST
  Top 0.203: U2.1 8.2,36.56 5.33,39.43 C13.1 | R23.1 1.62,37.53 2.41,38.32 2.41,38.58 C13.1 | 3.33,39.5 C13.1
XTAL0
  Top 0.203: U2.29 23.54,33.06 25.4,34.92 26.45,34.92 R1.1 27.36,34.98 28.1,35.72 28.1,40.48 29.37,41.75 33.18,41.75 33.66,41.27 33.66,40.86 | 33.66,40.86 33.66,39.04 Y1.1 | C2.2 33.59,40.8 33.66,40.86
XTAL1
  Top 0.203: U2.28 23.16,32.56 23.65,32.07 26.51,32.07 | 26.51,32.07 28.57,32.07 | 28.57,32.07 29.79,32.07 C1.2 | R1.2 26.51,32.07 | Y1.3 30.06,34.66 28.57,33.18 28.57,32.07

### Text on the board
Bottom: v10
tPlace: RDY | A0 | VIN | A1 | GND | PAPA / SOUNDIE | GND | SCK / D13 | 3.3V | MISO / D12 | SDA | RST | MOSI / D11 | SCL | D10 | RST | D9 | 3.3V | VLSI RDY | GND | UN | UP | RX | TX | L | R
bPlace: A0 | VIN | A1 | GND | GND | SCK / D13 | 3.3V | MISO / D12 | SDA | MOSI / D11 | SCL | PAPA / SOUNDIE | D10 | RST | D9 | Audio Player | 3.3V | GND | USBN | USBP | VS_RX | VS_TX | LEFT_AC | RIGHT_AC
Measures: All Units Inches
tDocu: Mary West